# Altium schematic sheet HyperRAM.SchDoc: Shaheen PCB Board
size A3; Author: Mattia Sinigaglia; CompanyName: University of Bologna; DrawnBy: Mattia Sinigaglia; Organization: EES - Micrel Lab; Revision: v1; SheetNumber: 1; SheetTotal: 6
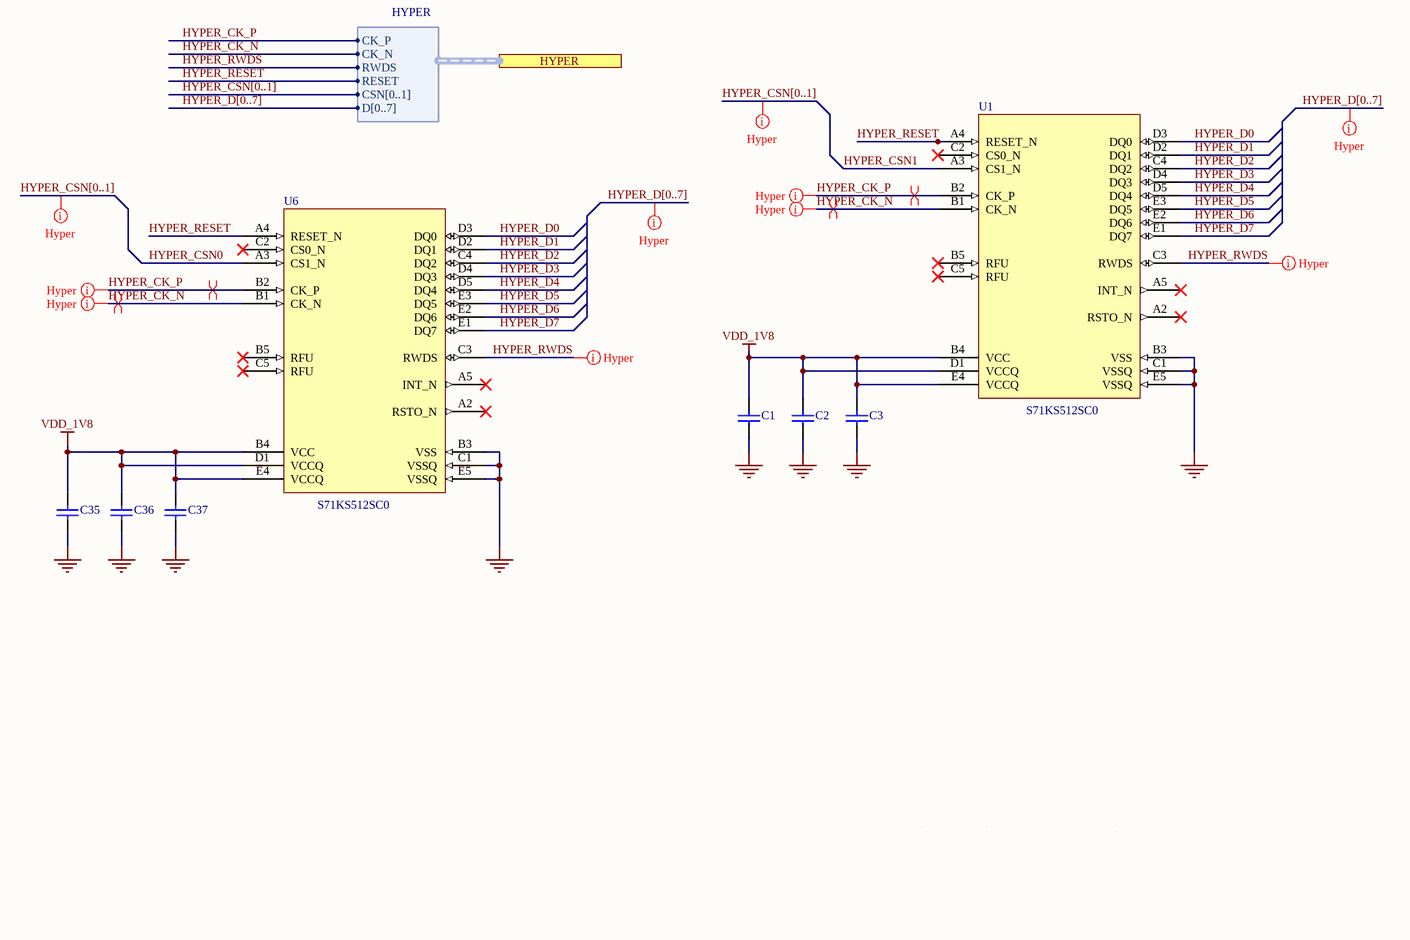
[diagram p0: HyperRAM.SchDoc]

## Parts
C1  VJ0603Y104KNXAO  [CAPC1608X92X38LL15T08]  (value not drawn)
C2  VJ0603Y104KNXAO  [CAPC1608X92X38LL15T08]  (value not drawn)
C3  VJ0603Y104KNXAO  [CAPC1608X92X38LL15T08]  (value not drawn)
C35  VJ0603Y104KNXAO  [CAPC1608X92X38LL15T08]  (value not drawn)
C36  VJ0603Y104KNXAO  [CAPC1608X92X38LL15T08]  (value not drawn)
C37  VJ0603Y104KNXAO  [CAPC1608X92X38LL15T08]  (value not drawn)
U1  S71KS512SC0  [FBGA24_A-130]
U6  S71KS512SC0  [FBGA24_A-130]

## Ports
HYPER (harness HYPER)

## Harnesses
HYPER: CK_N, CK_P, RWDS, CSN[0..1], D[0..7], RESET

## Nets
GND: C1.1 C2.1 C3.1 C35.1 C36.1 C37.1 U1.B3(VSS) U1.C1(VSSQ) U1.E5(VSSQ) U6.B3(VSS) U6.C1(VSSQ) U6.E5(VSSQ)
VDD_1V8: C1.2 C2.2 C3.2 C35.2 C36.2 C37.2 U1.B4(VCC) U1.D1(VCCQ) U1.E4(VCCQ) U6.B4(VCC) U6.D1(VCCQ) U6.E4(VCCQ)
HYPER_CK_N: U1.B1(CK_N) U6.B1(CK_N) ; port HYPER.CK_N
HYPER_CK_P: U1.B2(CK_P) U6.B2(CK_P) ; port HYPER.CK_P
HYPER_CSN0: U6.A3(CS1_N)
HYPER_CSN1: U1.A3(CS1_N)
HYPER_D0: U1.D3(DQ0) U6.D3(DQ0)
HYPER_D1: U1.D2(DQ1) U6.D2(DQ1)
HYPER_D2: U1.C4(DQ2) U6.C4(DQ2)
HYPER_D3: U1.D4(DQ3) U6.D4(DQ3)
HYPER_D4: U1.D5(DQ4) U6.D5(DQ4)
HYPER_D5: U1.E3(DQ5) U6.E3(DQ5)
HYPER_D6: U1.E2(DQ6) U6.E2(DQ6)
HYPER_D7: U1.E1(DQ7) U6.E1(DQ7)
HYPER_RESET: U1.A4(RESET_N) U6.A4(RESET_N) ; port HYPER.RESET
HYPER_RWDS: U1.C3(RWDS) U6.C3(RWDS) ; port HYPER.RWDS

Not connected (* = marked no-connect by the designer): U1 A2(RSTO_N)* A5(INT_N)* B5(RFU)* C2(CS0_N)* C5(RFU)*; U6 A2(RSTO_N)* A5(INT_N)* B5(RFU)* C2(CS0_N)* C5(RFU)*

## Buses and harness runs
bus HYPER_CSN[0..1]
bus HYPER_D[0..7]

## Layout directives
net class Hyper: (no net found under the mark), HYPER_CK_N, HYPER_CK_P, HYPER_RWDS
differential pair: HYPER_CK_N, HYPER_CK_P

## Notes on the sheet
- 1
- 2
- 3
- 4
- 5
- 6
- 7
- 8
- A
- B
- C
- D
- Project:
- Date:
- Drawing number:
- Rev:
- Format:
- A3
- Drawn by:
- Laboratory:
- Page
- Sheet:
- of
- File:

## Library data of the parts
C1-C3 C35-C37 = CMP-1035-02588-2: Manufacturer: Vitramon; Part Number: VJ0603Y104KNXAO